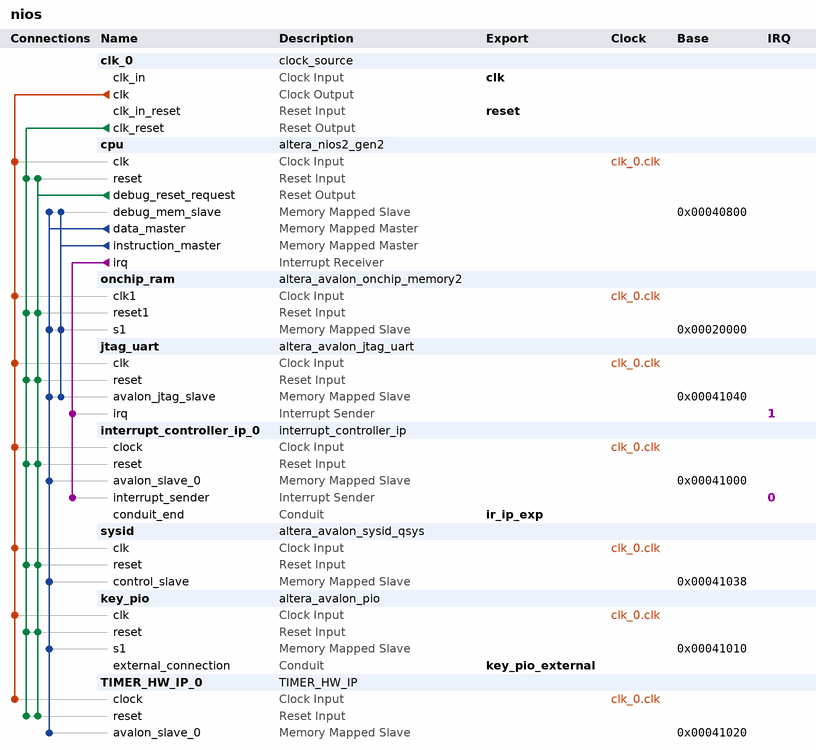
[diagram p0: system contents]
# Platform Designer (Qsys) system nios, MAX 10 10M50DAF484C7G
# Parameters at their usual value, and those the tool derives, are not listed.
package require -exact qsys 18.1
create_system nios
set_project_property DEVICE_FAMILY {MAX 10}
set_project_property DEVICE 10M50DAF484C7G

add_instance clk_0 clock_source 18.1
set_instance_parameter_value clk_0 clockFrequency 50000000

add_instance cpu altera_nios2_gen2 18.1
set_instance_parameter_value cpu dcache_size 2048
set_instance_parameter_value cpu exceptionSlave onchip_ram.s1
set_instance_parameter_value cpu icache_size 4096
set_instance_parameter_value cpu impl Tiny
set_instance_parameter_value cpu resetSlave onchip_ram.s1

add_instance onchip_ram altera_avalon_onchip_memory2 18.1
set_instance_parameter_value onchip_ram dataWidth 32
set_instance_parameter_value onchip_ram dualPort false
set_instance_parameter_value onchip_ram initMemContent false
set_instance_parameter_value onchip_ram initializationFileName onchip_mem.hex
set_instance_parameter_value onchip_ram memorySize 131072

add_instance jtag_uart altera_avalon_jtag_uart 18.1
set_instance_parameter_value jtag_uart simInteractiveOptions NO_INTERACTIVE_WINDOWS

add_instance interrupt_controller_ip_0 interrupt_controller_ip 1.0

add_instance sysid altera_avalon_sysid_qsys 18.1
set_instance_parameter_value sysid id 0

add_instance key_pio altera_avalon_pio 18.1
set_instance_parameter_value key_pio direction Input
set_instance_parameter_value key_pio width 2

add_instance TIMER_HW_IP_0 TIMER_HW_IP 1.0

# connections
add_connection clk_0.clk cpu.clk clock
add_connection clk_0.clk interrupt_controller_ip_0.clock clock
add_connection clk_0.clk jtag_uart.clk clock
add_connection clk_0.clk key_pio.clk clock
add_connection clk_0.clk onchip_ram.clk1 clock
add_connection clk_0.clk sysid.clk clock
add_connection clk_0.clk TIMER_HW_IP_0.clock clock
add_connection clk_0.clk_reset cpu.reset reset
add_connection clk_0.clk_reset interrupt_controller_ip_0.reset reset
add_connection clk_0.clk_reset jtag_uart.reset reset
add_connection clk_0.clk_reset key_pio.reset reset
add_connection clk_0.clk_reset onchip_ram.reset1 reset
add_connection clk_0.clk_reset sysid.reset reset
add_connection clk_0.clk_reset TIMER_HW_IP_0.reset reset
add_connection cpu.debug_reset_request cpu.reset reset
add_connection cpu.debug_reset_request interrupt_controller_ip_0.reset reset
add_connection cpu.debug_reset_request jtag_uart.reset reset
add_connection cpu.debug_reset_request key_pio.reset reset
add_connection cpu.debug_reset_request onchip_ram.reset1 reset
add_connection cpu.debug_reset_request sysid.reset reset
add_connection cpu.debug_reset_request TIMER_HW_IP_0.reset reset
add_connection cpu.data_master cpu.debug_mem_slave avalon
set_connection_parameter_value cpu.data_master/cpu.debug_mem_slave baseAddress 0x00040800
add_connection cpu.data_master interrupt_controller_ip_0.avalon_slave_0 avalon
set_connection_parameter_value cpu.data_master/interrupt_controller_ip_0.avalon_slave_0 baseAddress 0x00041000
add_connection cpu.data_master jtag_uart.avalon_jtag_slave avalon
set_connection_parameter_value cpu.data_master/jtag_uart.avalon_jtag_slave baseAddress 0x00041040
add_connection cpu.data_master key_pio.s1 avalon
set_connection_parameter_value cpu.data_master/key_pio.s1 baseAddress 0x00041010
add_connection cpu.data_master onchip_ram.s1 avalon
set_connection_parameter_value cpu.data_master/onchip_ram.s1 baseAddress 0x00020000
add_connection cpu.data_master sysid.control_slave avalon
set_connection_parameter_value cpu.data_master/sysid.control_slave baseAddress 0x00041038
add_connection cpu.data_master TIMER_HW_IP_0.avalon_slave_0 avalon
set_connection_parameter_value cpu.data_master/TIMER_HW_IP_0.avalon_slave_0 baseAddress 0x00041020
add_connection cpu.instruction_master cpu.debug_mem_slave avalon
set_connection_parameter_value cpu.instruction_master/cpu.debug_mem_slave baseAddress 0x00040800
add_connection cpu.instruction_master jtag_uart.avalon_jtag_slave avalon
set_connection_parameter_value cpu.instruction_master/jtag_uart.avalon_jtag_slave baseAddress 0x00041040
add_connection cpu.instruction_master onchip_ram.s1 avalon
set_connection_parameter_value cpu.instruction_master/onchip_ram.s1 baseAddress 0x00020000
add_connection cpu.irq interrupt_controller_ip_0.interrupt_sender interrupt
set_connection_parameter_value cpu.irq/interrupt_controller_ip_0.interrupt_sender irqNumber 0
add_connection cpu.irq jtag_uart.irq interrupt
set_connection_parameter_value cpu.irq/jtag_uart.irq irqNumber 1

# exported interfaces
add_interface clk clock sink
set_interface_property clk EXPORT_OF clk_0.clk_in
add_interface ir_ip_exp conduit end
set_interface_property ir_ip_exp EXPORT_OF interrupt_controller_ip_0.conduit_end
add_interface key_pio_external conduit end
set_interface_property key_pio_external EXPORT_OF key_pio.external_connection
add_interface reset reset sink
set_interface_property reset EXPORT_OF clk_0.clk_in_reset

set_interconnect_requirement {$system} qsys_mm.clockCrossingAdapter HANDSHAKE
set_interconnect_requirement {$system} qsys_mm.enableEccProtection FALSE
set_interconnect_requirement {$system} qsys_mm.insertDefaultSlave FALSE
set_interconnect_requirement {$system} qsys_mm.maxAdditionalLatency 1

save_system nios.qsys
